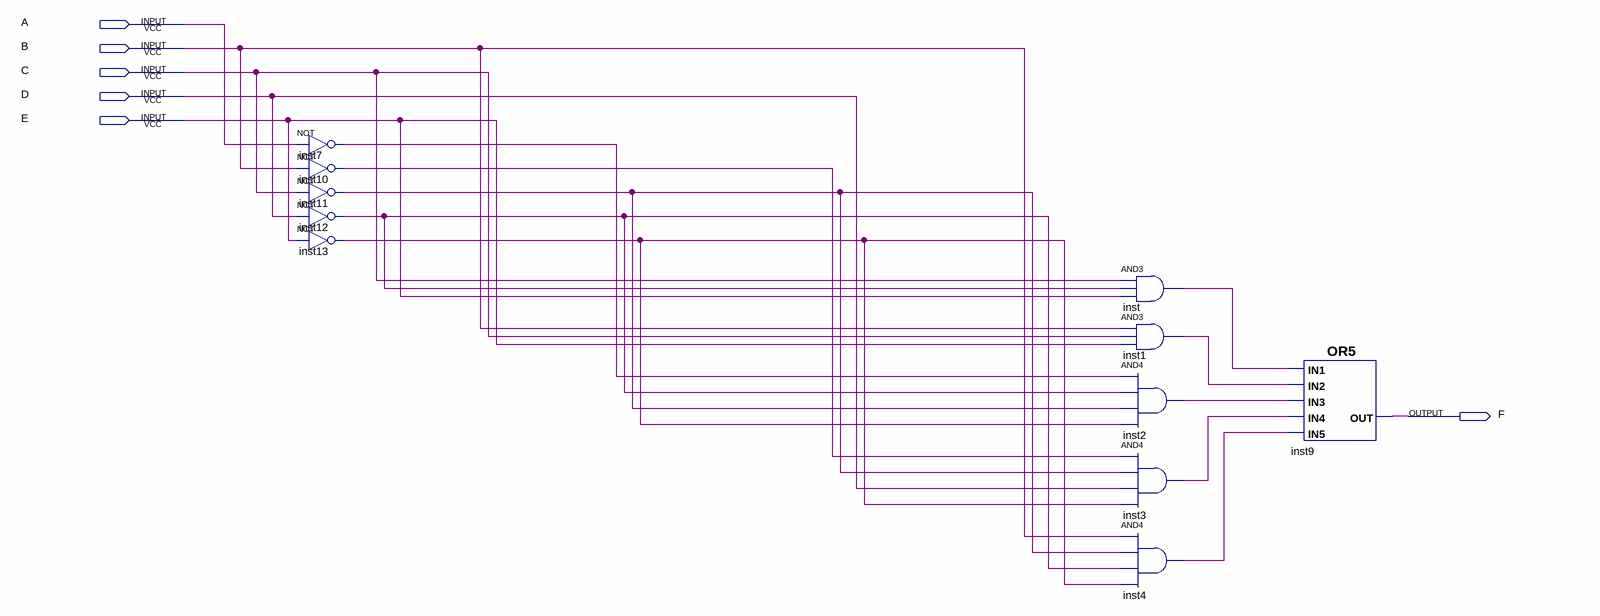
[diagram p0: schematic sheet]
// Quartus schematic Lab02_1.bdf as structural Verilog: 11 symbols, 6 pins
module Lab02_1 (
  input  A,
  input  B,
  input  C,
  input  D,
  input  E,
  output F
);

  wire inst1_out, inst2_out, inst3_out, inst4_out, inst7_out, inst10_out, inst11_out, inst12_out, inst13_out,
       inst_out;

  not inst7 (inst7_out, A);
  not inst10 (inst10_out, B);
  not inst11 (inst11_out, C);
  not inst12 (inst12_out, D);
  not inst13 (inst13_out, E);
  and inst (inst_out, C, inst12_out, E);
  and inst1 (inst1_out, B, C, E);
  and inst2 (inst2_out, inst7_out, inst12_out, inst11_out, inst13_out);
  and inst3 (inst3_out, inst10_out, inst11_out, D, inst13_out);
  and inst4 (inst4_out, B, inst11_out, inst12_out, inst13_out);
  or inst9 (F, inst_out, inst1_out, inst2_out, inst3_out, inst4_out);
endmodule
